# EAGLE design Teensylu2-0.7 (EAGLE 7.1.0)
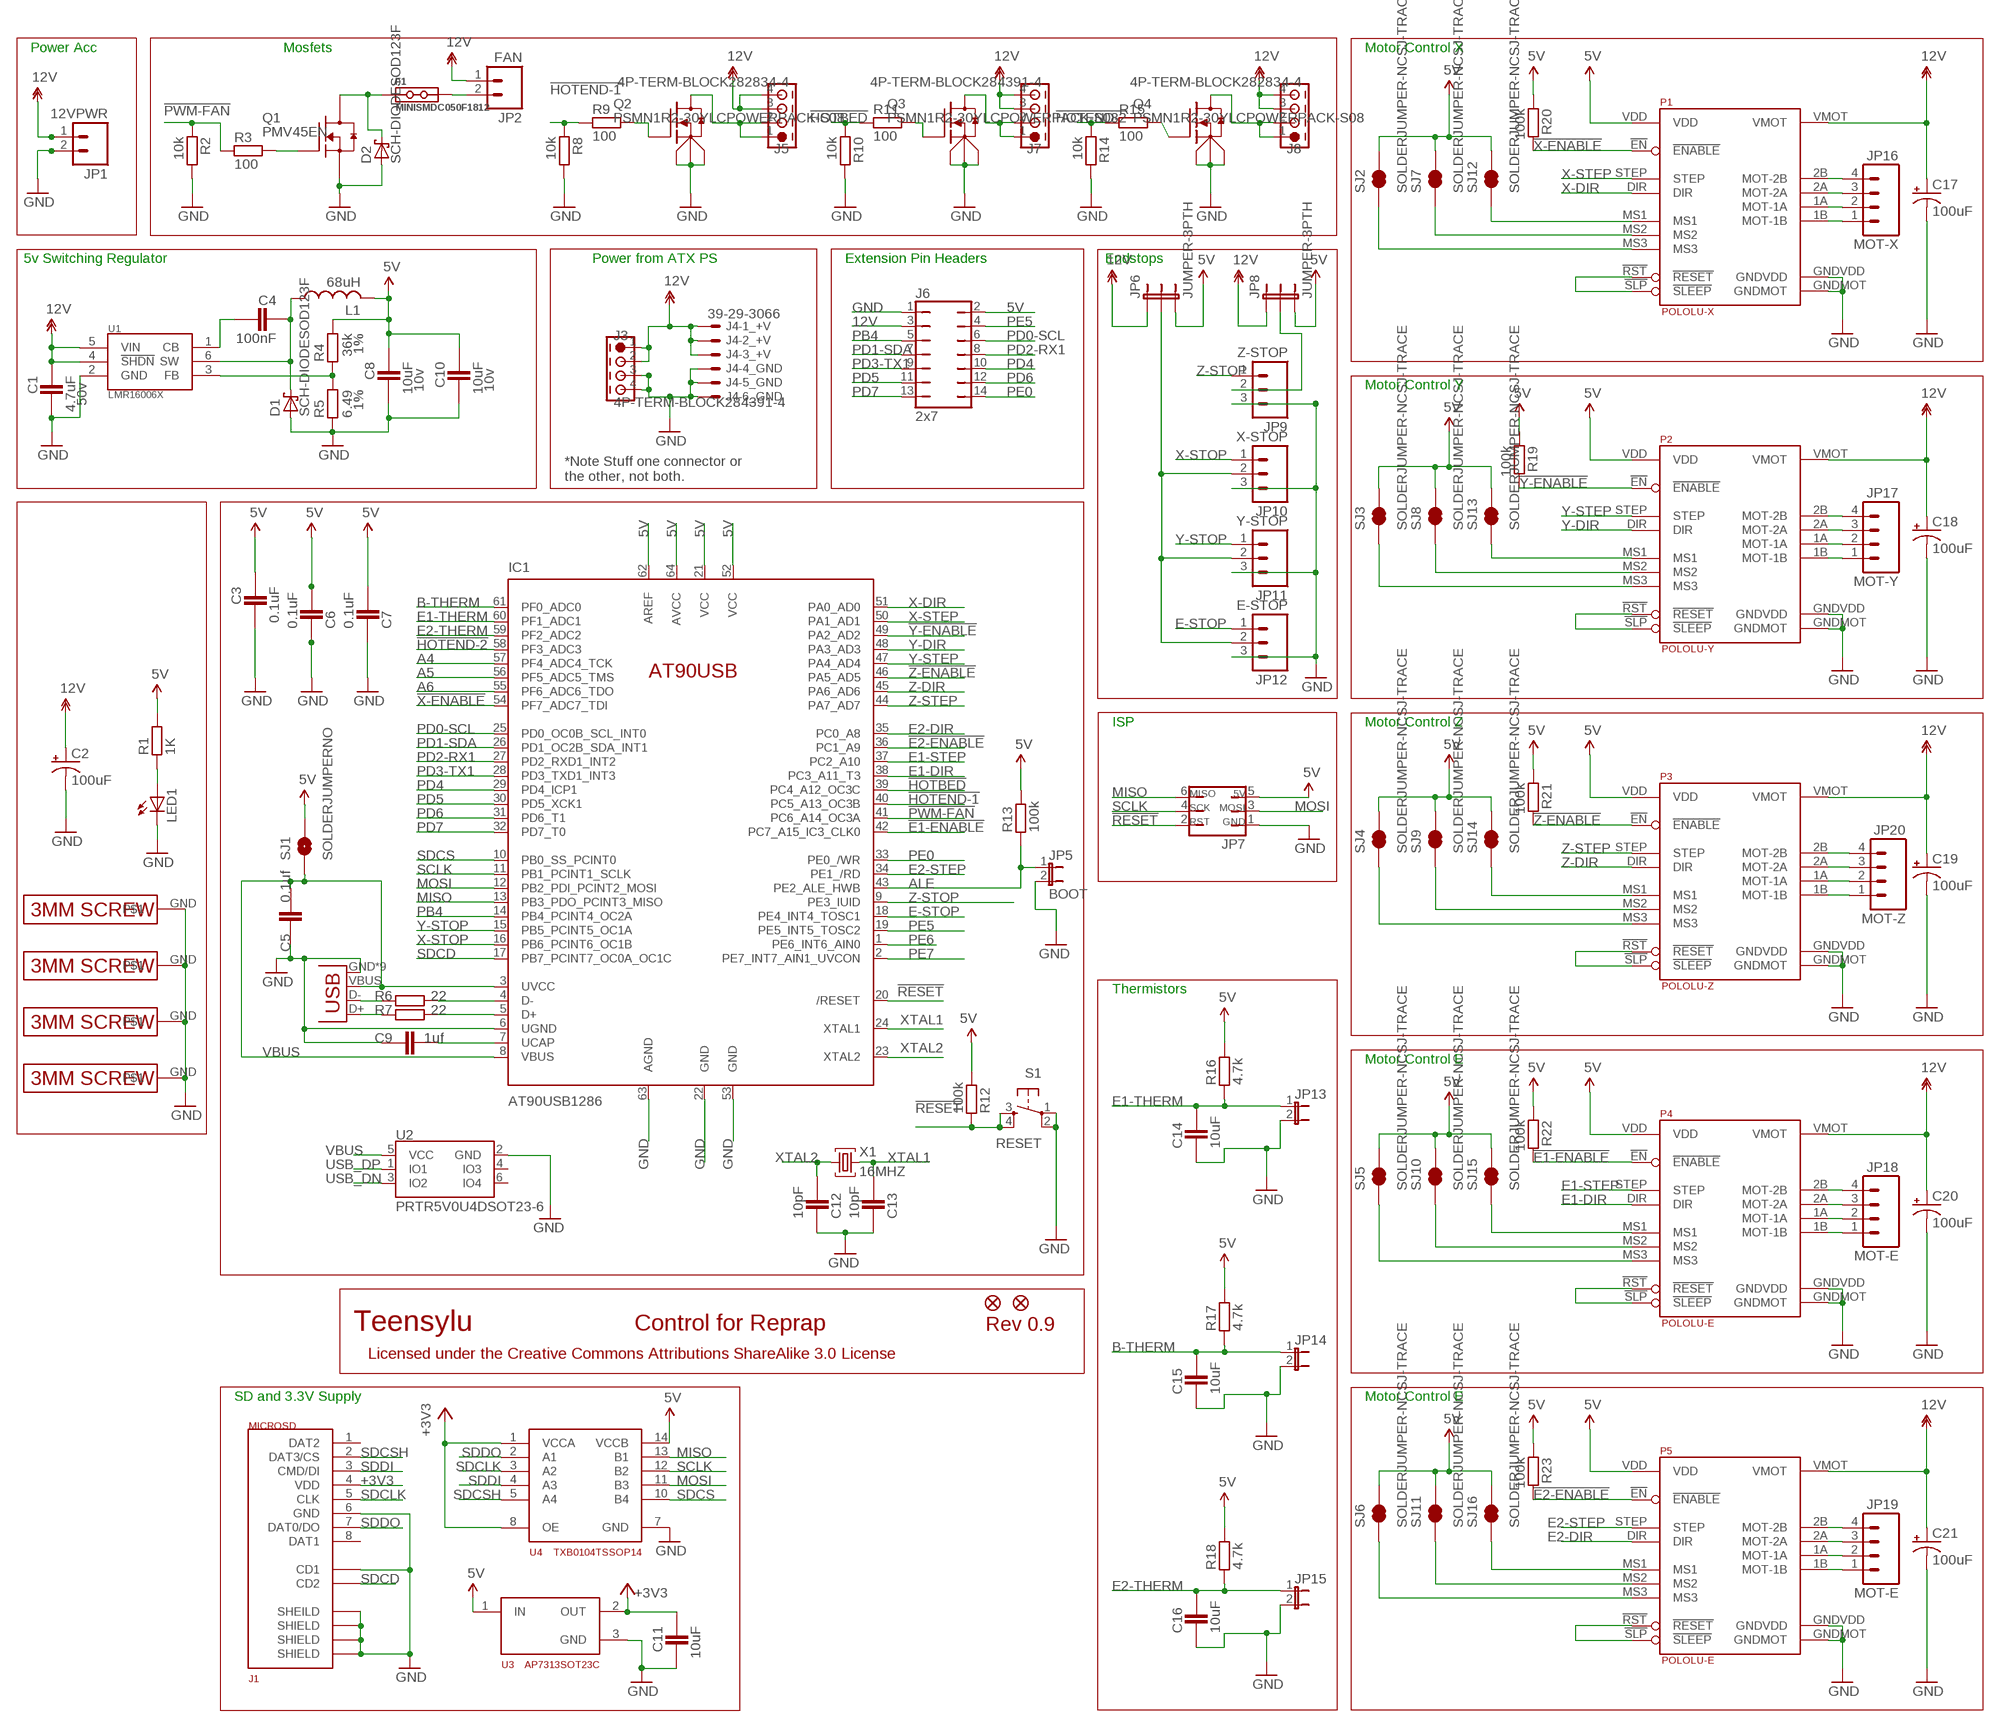
[diagram p0: schematic, sheet 1]

## Parts
C1  4.7uF  CAPACITOR_0805  [CAPC2012X145AN]
C2  100uF  CPOL-USD  [PANASONIC_D]
C3  0.1uF  CAPACITOR_0603  [CAPC1608X92N]
C4  100nF  CAPACITOR_0603  [CAPC1608X92N]
C5  0.1uf  CAPACITOR_0603  [CAPC1608X92N]
C6  0.1uF  CAPACITOR_0603  [CAPC1608X92N]
C7  0.1uF  CAPACITOR_0603  [CAPC1608X92N]
C8  10uF  CAPACITOR_0805  [CAPC2012X145AN]
C9  1uf  CAPACITOR_0603  [CAPC1608X92N]
C10  10uF  CAPACITOR_0805  [CAPC2012X145AN]
C11  10uF  CAPACITOR_0603  [CAPC1608X92N]
C12  10pF  CAPACITOR_0603  [CAPC1608X92N]
C13  10pF  CAPACITOR_0603  [CAPC1608X92N]
C14  10uF  CAPACITOR_0603  [CAPC1608X92N]
C15  10uF  CAPACITOR_0603  [CAPC1608X92N]
C16  10uF  CAPACITOR_0603  [CAPC1608X92N]
C17  100uF  CPOL-USD  [PANASONIC_D]
C18  100uF  CPOL-USD  [PANASONIC_D]
C19  100uF  CPOL-USD  [PANASONIC_D]
C20  100uF  CPOL-USD  [PANASONIC_D]
C21  100uF  CPOL-USD  [PANASONIC_D]
D1  SCH-DIODESOD123F  [SOD123F]
D2  SCH-DIODESOD123F  [SOD123F]
F1  MINISMDC050F1812  [MINISMDC]
IC1  AT90USB1286  AT90USB  [TQFP64-2]
J1  MICROSD  [AMPHENOL-MICROSD]
J2  USB-MICRO-PTH  [USB-MICROB-PTH]
J3  4P-TERM-BLOCK284391-4  [284391-4]
J4  39-29-3066  [39-29-3066]
J5  4P-TERM-BLOCK282834-4  [282834-4]
J6  2x7  JP7Q  [JP7Q]
J7  4P-TERM-BLOCK284391-4  [284391-4]
J8  4P-TERM-BLOCK282834-4  [282834-4]
JP1  12VPWR  M02POLAR  [MOLEX-1X2]
JP2  FAN  M02POLAR  [MOLEX-1X2]
JP3  FIDUCIAL1X2.5  [FIDUCIAL-1X2.5]
JP4  FIDUCIAL1X2.5  [FIDUCIAL-1X2.5]
JP5  BOOT  JUMPER-2PTH  [1X02]
JP6  JUMPER-3PTH  [1X03]
JP7  PROGHEADER  [ISP]
JP8  JUMPER-3PTH  [1X03]
JP9  Z-STOP  M03POLAR  [MOLEX-1X3]
JP10  X-STOP  M03POLAR  [MOLEX-1X3]
JP11  Y-STOP  M03POLAR  [MOLEX-1X3]
JP12  E-STOP  M03POLAR  [MOLEX-1X3]
JP13  JUMPER-2PTH  [1X02]
JP14  JUMPER-2PTH  [1X02]
JP15  JUMPER-2PTH  [1X02]
JP16  MOT-X  M04POLAR  [MOLEX-1X4]
JP17  MOT-Y  M04POLAR  [MOLEX-1X4]
JP18  MOT-E  M04POLAR  [MOLEX-1X4]
JP19  MOT-E  M04POLAR  [MOLEX-1X4]
JP20  MOT-Z  M04POLAR  [MOLEX-1X4]
L1  68uH  INDUCTORSRN6045  [SRN6045]
LED1  LEDCHIPLED_0805  [CHIPLED_0805]
P1  POLOLU-X  POLOLU-ALLEGRO  [POLOLU-STEPPER-PTH]
P2  POLOLU-Y  POLOLU-ALLEGRO  [POLOLU-STEPPER-PTH]
P3  POLOLU-Z  POLOLU-ALLEGRO  [POLOLU-STEPPER-PTH]
P4  POLOLU-E  POLOLU-ALLEGRO  [POLOLU-STEPPER-PTH]
P5  POLOLU-E  POLOLU-ALLEGRO  [POLOLU-STEPPER-PTH]
Q1  PMV45EN  MOSFET-NCH_SOT-23  [SOT23C]
Q2  PSMN1R2-30YLCPOWERPACK-S08  [LFPACK-POWERPAK-SO8]
Q3  PSMN1R2-30YLCPOWERPACK-S08  [LFPACK-POWERPAK-SO8]
Q4  PSMN1R2-30YLCPOWERPACK-S08  [LFPACK-POWERPAK-SO8]
R1  1K  RESISTOR_0603  [RESC1608X55N]
R2  10k  RESISTOR_0603  [RESC1608X55N]
R3  100  RESISTOR_0603  [RESC1608X55N]
R4  36k  RESISTOR_0603  [RESC1608X55N]
R5  6.49  RESISTOR_0603  [RESC1608X55N]
R6  22  RESISTOR_0603  [RESC1608X55N]
R7  22  RESISTOR_0603  [RESC1608X55N]
R8  10k  RESISTOR_0603  [RESC1608X55N]
R9  100  RESISTOR_0603  [RESC1608X55N]
R10  10k  RESISTOR_0603  [RESC1608X55N]
R11  100  RESISTOR_0603  [RESC1608X55N]
R12  100k  RESISTOR_0603  [RESC1608X55N]
R13  100k  RESISTOR_0603  [RESC1608X55N]
R14  10k  RESISTOR_0603  [RESC1608X55N]
R15  100  RESISTOR_0603  [RESC1608X55N]
R16  4.7k  RESISTOR_0603  [RESC1608X55N]
R17  4.7k  RESISTOR_0603  [RESC1608X55N]
R18  4.7k  RESISTOR_0603  [RESC1608X55N]
R19  100k  RESISTOR_0603  [RESC1608X55N]
R20  100k  RESISTOR_0603  [RESC1608X55N]
R21  100k  RESISTOR_0603  [RESC1608X55N]
R22  100k  RESISTOR_0603  [RESC1608X55N]
R23  100k  RESISTOR_0603  [RESC1608X55N]
S1  RESET  TAC_SWITCHPTH  [TACTILE-PTH]
SCREW1  3MM-SCREW  [PLATEDSCREW]
SCREW2  3MM-SCREW  [PLATEDSCREW]
SCREW3  3MM-SCREW  [PLATEDSCREW]
SCREW4  3MM-SCREW  [PLATEDSCREW]
SJ1  SOLDERJUMPERNO  [SJ_2S-NO]
SJ2  SOLDERJUMPER-NCSJ-TRACE  [SJ_2S-TRACE]
SJ3  SOLDERJUMPER-NCSJ-TRACE  [SJ_2S-TRACE]
SJ4  SOLDERJUMPER-NCSJ-TRACE  [SJ_2S-TRACE]
SJ5  SOLDERJUMPER-NCSJ-TRACE  [SJ_2S-TRACE]
SJ6  SOLDERJUMPER-NCSJ-TRACE  [SJ_2S-TRACE]
SJ7  SOLDERJUMPER-NCSJ-TRACE  [SJ_2S-TRACE]
SJ8  SOLDERJUMPER-NCSJ-TRACE  [SJ_2S-TRACE]
SJ9  SOLDERJUMPER-NCSJ-TRACE  [SJ_2S-TRACE]
SJ10  SOLDERJUMPER-NCSJ-TRACE  [SJ_2S-TRACE]
SJ11  SOLDERJUMPER-NCSJ-TRACE  [SJ_2S-TRACE]
SJ12  SOLDERJUMPER-NCSJ-TRACE  [SJ_2S-TRACE]
SJ13  SOLDERJUMPER-NCSJ-TRACE  [SJ_2S-TRACE]
SJ14  SOLDERJUMPER-NCSJ-TRACE  [SJ_2S-TRACE]
SJ15  SOLDERJUMPER-NCSJ-TRACE  [SJ_2S-TRACE]
SJ16  SOLDERJUMPER-NCSJ-TRACE  [SJ_2S-TRACE]
U1  LMR16006X  [TSOT6]
U2  PRTR5V0U4DSOT23-6  [SOT23-6]
U3  AP7313SOT23C  [SOT23C]
U4  TXB0104TSSOP14  [TSSOP14]
X1  16MHZ  XTAL  [NDK-XTAL]

## Nets
5V [power]: C3.1 C6.2 C7.2 C8.1 C10.1 IC1.21(VCC) IC1.52(VCC) IC1.62(AREF) IC1.64(AVCC) J6.2 JP6.3 JP7.5 JP8.3 L1.2 P1.VDD P2.VDD P3.VDD P4.VDD P5.VDD R1.2 R4.1 R12.2 R13.2 R16.2 R17.2 R18.2 R19.1 R20.1 R21.1 R22.1 R23.1 SJ1.2 SJ2.2 SJ3.2 SJ4.2 SJ5.2 SJ6.2 SJ7.2 SJ8.2 SJ9.2 SJ10.2 SJ11.2 SJ12.2 SJ13.2 SJ14.2 SJ15.2 SJ16.2 U3.1(IN) U4.14(VCCB)
5VREG_CB: C4.2 U1.1(CB)
5VREG_FB: R4.2 R5.1 U1.3(FB)
5VREG_SW: C4.1 D1.C L1.1 U1.6(SW)
12V: C1.1 C2.+ C17.+ C18.+ C19.+ C20.+ C21.+ J3.1 J3.2 J4.1 J4.2 J4.3 J5.3 J5.4 J6.3 J7.3 J7.4 J8.3 J8.4 JP1.1 JP2.1 JP6.1 JP8.1 P1.VMOT P2.VMOT P3.VMOT P4.VMOT P5.VMOT U1.4(!SHDN) U1.5(VIN)
!E1-ENABLE: IC1.42(PC7_A15_IC3_CLK0) P4.!EN(!ENABLE) R22.2
!E2-ENABLE: IC1.36(PC1_A9) P5.!EN(!ENABLE) R23.2
!HOTBED: IC1.39(PC4_A12_OC3C) R10.1 R11.1
!HOTEND-1: IC1.40(PC5_A13_OC3B) R8.1 R9.1
!HOTEND-2: IC1.58(PF3_ADC3) R14.1 R15.1
!PWM-FAN: IC1.41(PC6_A14_OC3A) R2.1 R3.1
!RESET: IC1.20(/RESET) JP7.2 R12.1 S1.3 S1.4
!X-ENABLE: IC1.54(PF7_ADC7_TDI) P1.!EN(!ENABLE) R20.2
!Y-ENABLE: IC1.49(PA2_AD2) P2.!EN(!ENABLE) R19.2
!Z-ENABLE: IC1.46(PA5_AD5) P3.!EN(!ENABLE) R21.2
+3V3 [power]: C11.1 J1.4(VDD) U3.2(OUT) U4.1(VCCA) U4.8(OE)
A4: IC1.57(PF4_ADC4_TCK)
A5: IC1.56(PF5_ADC5_TMS)
A6: IC1.55(PF6_ADC6_TDO)
ALE: IC1.43(PE2_ALE_HWB) JP5.1 R13.1
B-THERM: C15.2 IC1.61(PF0_ADC0) JP14.1 R17.1
E1-DIR: IC1.38(PC3_A11_T3) P4.DIR
E1-STEP: IC1.37(PC2_A10) P4.STEP
E1-THERM: C14.2 IC1.60(PF1_ADC1) JP13.1 R16.1
E2-DIR: IC1.35(PC0_A8) P5.DIR
E2-STEP: IC1.34(PE1_/RD) P5.STEP
E2-THERM: C16.2 IC1.59(PF2_ADC2) JP15.1 R18.1
E-MOT-1A [power]: JP18.2 P4.1A(MOT-1A)
E-MOT-1A1 [power]: JP19.2 P5.1A(MOT-1A)
E-MOT-1B [power]: JP18.1 P4.1B(MOT-1B)
E-MOT-1B1 [power]: JP19.1 P5.1B(MOT-1B)
E-MOT-2A [power]: JP18.3 P4.2A(MOT-2A)
E-MOT-2A1 [power]: JP19.3 P5.2A(MOT-2A)
E-MOT-2B [power]: JP18.4 P4.2B(MOT-2B)
E-MOT-2B1 [power]: JP19.4 P5.2B(MOT-2B)
E-MS1: P4.MS1 SJ15.1
E-MS2: P4.MS2 SJ10.1
E-MS3: P4.MS3 SJ5.1
E-MS4: P5.MS1 SJ16.1
E-MS5: P5.MS2 SJ11.1
E-MS6: P5.MS3 SJ6.1
E-RESETSLEEP: P4.!RST(!RESET) P4.!SLP(!SLEEP)
E-RESETSLEEP1: P5.!RST(!RESET) P5.!SLP(!SLEEP)
E-STOP: IC1.18(PE4_INT4_TOSC1) JP12.1
ENDSTOP+V: JP6.2 JP10.2 JP11.2 JP12.2
GND [power]: C1.2 C2.- C3.2 C5.1 C6.1 C7.1 C8.2 C9.1 C10.2 C11.2 C12.1 C13.1 C14.1 C15.1 C16.1 C17.- C18.- C19.- C20.- C21.- D1.A D2.A IC1.6(UGND) IC1.22(GND) IC1.53(GND) IC1.63(AGND) J1.6(GND) J1.C1(SHEILD) J1.C2(SHIELD) J1.C3(SHIELD) J1.C4(SHIELD) J1.CD1 J2.GND J2.GND1(GND) J2.GND2(GND) J2.GND3(GND) J2.GND4(GND) J2.GND5(GND) J2.GND6(GND) J2.GND7(GND) J2.GND8(GND) J3.3 J3.4 J4.4 J4.5 J4.6 J6.1 JP1.2 JP5.2 JP7.1 JP9.3 JP10.3 JP11.3 JP12.3 JP13.2 JP14.2 JP15.2 LED1.C P1.GNDMOT P1.GNDVDD P2.GNDMOT P2.GNDVDD P3.GNDMOT P3.GNDVDD P4.GNDMOT P4.GNDVDD P5.GNDMOT P5.GNDVDD Q1.2(S) Q2.1(S1) Q2.2(S2) Q2.3(S3) Q3.1(S1) Q3.2(S2) Q3.3(S3) Q4.1(S1) Q4.2(S2) Q4.3(S3) R2.2 R5.2 R8.2 R10.2 R14.2 S1.1 S1.2 SCREW1.GND SCREW2.GND SCREW3.GND SCREW4.GND U1.2(GND) U2.2(GND) U3.3(GND) U4.7(GND)
HOTBED-GND [power]: J7.1 J7.2 Q3.5-8(D)
HOTEND-GND [power]: J5.1 J5.2 Q2.5-8(D)
HOTEND-GND1 [power]: J8.1 J8.2 Q4.5-8(D)
MISO: IC1.13(PB3_PDO_PCINT3_MISO) JP7.6 U4.13(B1)
MOSI: IC1.12(PB2_PDI_PCINT2_MOSI) JP7.3 U4.11(B3)
N$1: LED1.A R1.1
N$2: Q3.4(G) R11.2
N$3: IC1.4(D-) R6.2
N$4: IC1.5(D+) R7.2
N$5: F1.P$2 JP2.2
N$6: D2.C F1.P$1 Q1.3(D)
N$10: Q1.1(G) R3.2
N$11: Q2.4(G) R9.2
N$13: Q4.4(G) R15.2
PB4: IC1.14(PB4_PCINT4_OC2A) J6.5
PD0-SCL: IC1.25(PD0_OC0B_SCL_INT0) J6.6
PD1-SDA: IC1.26(PD1_OC2B_SDA_INT1) J6.7
PD2-RX1: IC1.27(PD2_RXD1_INT2) J6.8
PD3-TX1: IC1.28(PD3_TXD1_INT3) J6.9
PD4: IC1.29(PD4_ICP1) J6.10
PD5: IC1.30(PD5_XCK1) J6.11
PD6: IC1.31(PD6_T1) J6.12
PD7: IC1.32(PD7_T0) J6.13
PE0: IC1.33(PE0_/WR) J6.14
PE5: IC1.19(PE5_INT5_TOSC2) J6.4
PE6: IC1.1(PE6_INT6_AIN0)
PE7: IC1.2(PE7_INT7_AIN1_UVCON)
SCLK: IC1.11(PB1_PCINT1_SCLK) JP7.4 U4.12(B2)
SDCD: IC1.17(PB7_PCINT7_OC0A_OC1C) J1.CD2
SDCLK: J1.5(CLK) U4.3(A2)
SDCS: IC1.10(PB0_SS_PCINT0) U4.10(B4)
SDCSH: J1.2(DAT3/CS) U4.5(A4)
SDDI: J1.3(CMD/DI) U4.4(A3)
SDDO: J1.7(DAT0/DO) U4.2(A1)
UCAP: C9.2 IC1.7(UCAP)
USB_DN: J2.D- R6.1 U2.3(IO2)
USB_DP: J2.D+ R7.1 U2.1(IO1)
VBUS: C5.2 IC1.3(UVCC) IC1.8(VBUS) J2.VBUS SJ1.1 U2.5(VCC)
X-DIR: IC1.51(PA0_AD0) P1.DIR
X-MOT-1A [power]: JP16.2 P1.1A(MOT-1A)
X-MOT-1B [power]: JP16.1 P1.1B(MOT-1B)
X-MOT-2A [power]: JP16.3 P1.2A(MOT-2A)
X-MOT-2B [power]: JP16.4 P1.2B(MOT-2B)
X-MS1: P1.MS1 SJ12.1
X-MS2: P1.MS2 SJ7.1
X-MS3: P1.MS3 SJ2.1
X-RESETSLEEP: P1.!RST(!RESET) P1.!SLP(!SLEEP)
X-STEP: IC1.50(PA1_AD1) P1.STEP
X-STOP: IC1.16(PB6_PCINT6_OC1B) JP10.1
XTAL1: C13.2 IC1.24(XTAL1) X1.P$2
XTAL2: C12.2 IC1.23(XTAL2) X1.P$1
Y-DIR: IC1.48(PA3_AD3) P2.DIR
Y-MOT-1A [power]: JP17.2 P2.1A(MOT-1A)
Y-MOT-1B [power]: JP17.1 P2.1B(MOT-1B)
Y-MOT-2A [power]: JP17.3 P2.2A(MOT-2A)
Y-MOT-2B [power]: JP17.4 P2.2B(MOT-2B)
Y-MS1: P2.MS1 SJ13.1
Y-MS2: P2.MS2 SJ8.1
Y-MS3: P2.MS3 SJ3.1
Y-RESETSLEEP: P2.!RST(!RESET) P2.!SLP(!SLEEP)
Y-STEP: IC1.47(PA4_AD4) P2.STEP
Y-STOP: IC1.15(PB5_PCINT5_OC1A) JP11.1
Z-DIR: IC1.45(PA6_AD6) P3.DIR
Z-MOT-1A [power]: JP20.2 P3.1A(MOT-1A)
Z-MOT-1B [power]: JP20.1 P3.1B(MOT-1B)
Z-MOT-2A [power]: JP20.3 P3.2A(MOT-2A)
Z-MOT-2B [power]: JP20.4 P3.2B(MOT-2B)
Z-MS1: P3.MS1 SJ14.1
Z-MS2: P3.MS2 SJ9.1
Z-MS3: P3.MS3 SJ4.1
Z-RESETSLEEP: P3.!RST(!RESET) P3.!SLP(!SLEEP)
Z-STEP: IC1.44(PA7_AD7) P3.STEP
Z-STOP: IC1.9(PE3_IUID) JP9.1
Z-STOP-SUPPLY: JP8.2 JP9.2
Unconnected: J1.1(DAT2) J1.8(DAT1) U2.4(IO3) U2.6(IO4)

## Notes on the sheet
- Power Acc | Mosfets | Motor Control X
- 5v Switching Regulator | Power from ATX PS | Extension Pin Headers | Endstops
- Motor Control Y
- *Note Stuff one connector or
  the other, not both.
- ISP | Motor Control Z
- Thermistors
- Motor Control E
- Teensylu | Control for Reprap | Rev 0.9
- Licensed under the Creative Commons Attributions ShareAlike 3.0 License
- SD and 3.3V Supply | Motor Control E

## Library data of the parts
C1 = teensylu:CAPACITOR_; VDC: 50v
C2 C17-C21 = rcl:CPOL-US: POLARIZED CAPACITOR, American symbol; MANUFACTURER: Panasonic; MANUFACTURER_PART_NUMBER: EEE-FTH101XAP; TOLERANCE: 20%; VDC: 50v
C3 C6 C7 = teensylu:CAPACITOR_; VDC: 10v
C4 = teensylu:CAPACITOR_; ESR: 0.0064; VDC: 50
C5 C9 C11-C16 = teensylu:CAPACITOR_
C8 C10 = teensylu:CAPACITOR_; ESR: 0.0030; VDC: 10v
D1 D2 = teensylu:SCH-DIODE: Schottky Diodes Source: Fairchild .. BAT54.pdf; CURRENT: 1A; MANUFACTURER: NXP Semiconductors; MANUFACTURER_PART_NUMBER: PMEG4010CEH,115; REVERSE_VOLTAGE: 40V
F1 = teensylu:MINISMDC050F; CURRENT: 0.5A; MANUFACTURER: TE Connectivity; MANUFACTURER_PART_NUMBER: MINISMDC050F-2
IC1 = teensylu:AT90USB
J1 = teensylu:MICROSD; MANUFACTURER: Amphenol; MANUFACTURER_PART_NUMBER: 114-00841-68
J2 = teensylu:USB: USB Connectors USB-B-PTH is fully proven SKU : PRT-00139 USB-miniB is fully proven SKU : PRT-00587 USB-A-PCB is untested. USB-A-H is throughly reviewed, but untested. Spark Fun Electronics SKU : PRT-00437 USB-B-SMT is throughly reviewed, but untested. Needs silkscreen touching up. USB-A-S has not been used/tested USB-MB-H has not been used/tested; MANUFACTURER: FCI; MANUFACTURER_PART_NUMBER: 10118194-0001LF
J3 J7 = teensylu:4P-TERM-BLOCK; CURRENT: 12A; MANUFACTURER: TE Connectivity; MANUFACTURER_PART_NUMBER: 284391-4
J4 = teensylu:39-29-3066: Mini FIT connector 6 pol Without Snap-in peg Source: http://www.molex.com; MANUFACTURER: Molex; MANUFACTURER_PART_NUMBER: 0039293066
J5 J8 = teensylu:4P-TERM-BLOCK; CURRENT: 10A; MANUFACTURER: TE Connectivity; MANUFACTURER_PART_NUMBER: 282834-4
J6 = teensylu:JP7Q: JUMPER
JP1 JP2 = teensylu:M02: Header 2 Standard 2-pin 0.1" header. Use with straight break away headers (SKU : PRT-00116), right angle break away headers (PRT-00553), swiss pins (PRT-00743), machine pins (PRT-00117), and female headers (PRT-00115). Molex polarized connector foot print use with SKU : PRT-08233 with associated crimp pins and housings.
JP3 JP4 = SparkFun:FIDUCIAL: Fiducial Alignment Points Various fiducial points for machine vision alignment.
JP5 JP13-JP15 = teensylu:JUMPER-2: Jumper Basic 0.1" spaced jumper. Use with breakaway headers.
JP6 JP8 = teensylu:JUMPER-3
JP7 = teensylu:PROGHEADER: JUMPER
JP9-JP12 = teensylu:M03: Header 3 Standard 3-pin 0.1" header. Use with straight break away headers (SKU : PRT-00116), right angle break away headers (PRT-00553), swiss pins (PRT-00743), machine pins (PRT-00117), and female headers (PRT-00115). Molex polarized connector foot print use with SKU : PRT-08232 with associated crimp pins and housings.
JP16-JP20 = teensylu:M04: Header 4 Standard 4-pin 0.1" header. Use with straight break away headers (SKU : PRT-00116), right angle break away headers (PRT-00553), swiss pins (PRT-00743), machine pins (PRT-00117), and female headers (PRT-00115). Molex polarized connector foot print use with SKU : PRT-08231 with associated crimp pins and housings. 1MM SMD Version SKU: PRT-10208
L1 = teensylu:INDUCTOR; CURRENT: 900mA; DCR: 0.351; INDUCTANCE: 68uH; IRMS: 0.9A; MANUFACTURER: Bourns; MANUFACTURER_PART_NUMBER: SRN6045-680M
LED1 = led:LED: LED OSRAM: - CHIPLED LG R971, LG N971, LY N971, LG Q971, LY Q971, LO R971, LY R971 LH N974, LH R974 LS Q976, LO Q976, LY Q976 LO Q996 - Hyper CHIPLED LW Q18S LB Q993, LB Q99A, LB R99A - SideLED LS A670, LO A670, LY A670, LG A670, LP A670 LB A673, LV A673, LT A673, LW A673 LH A674 LY A675 LS A676, LA A676, LO A676, LY A676, LW A676 LS A679, LY A679, LG A679 - Hyper Micro SIDELED® LS Y876, LA Y876, LO Y876, LY Y876 LT Y87S - SmartLED LW L88C, LW L88S LB L89C, LB L89S, LG L890 LS L89K, LO L89K, LY L89K LS L896, LA L896, LO L896, LY L896 - TOPLED LS T670, LO T670, LY T670, LG T670, LP T670 LSG T670, LSP T670, LSY T670, LOP T670, LYG T670 LG T671, LOG T671, LSG T671 LB T673, LV T673, LT T673, LW T673 LH T674 LS T676, LA T676, LO T676, LY T676, LB T676, LH T676, LSB T676, LW T676 LB T67C, LV T67C, LT T67C, LS T67K, LO T67K, LY T67K, LW E67C LS E67B, LA E67B, LO E67B, LY E67B, LB E67C, LV E67C, LT E67C LW T67C LS T679, LY T679, LG T679 LS T770, LO T770, LY T770, LG T770, LP T770 LB T773, LV T773, LT T773, LW T773 LH T774 LS E675, LA E675, LY E675, LS T675 LS T776, LA T776, LO T776, LY T776, LB T776 LHGB T686 LT T68C, LB T68C - Hyper Mini TOPLED® LB M676 - Mini TOPLED Santana® LG M470 LS M47K, LO M47K, LY M47K Source: http://www.osram.convergy.de LUXEON: - LUMILED® LXK2-PW12-R00, LXK2-PW12-S00, LXK2-PW14-U00, LXK2-PW14-V00 LXK2-PM12-R00, LXK2-PM12-S00, LXK2-PM14-U00 LXK2-PE12-Q00, LXK2-PE12-R00, LXK2-PE12-S00, LXK2-PE14-T00, LXK2-PE14-U00 LXK2-PB12-K00, LXK2-PB12-L00, LXK2-PB12-M00, LXK2-PB14-N00, LXK2-PB14-P00, LXK2-PB14-Q00 LXK2-PR12-L00, LXK2-PR12-M00, LXK2-PR14-Q00, LXK2-PR14-R00 LXK2-PD12-Q00, LXK2-PD12-R00, LXK2-PD12-S00 LXK2-PH12-R00, LXK2-PH12-S00 LXK2-PL12-P00, LXK2-PL12-Q00, LXK2-PL12-R00 Source: www.luxeon.com KINGBRIGHT: KA-3528ASYC Source: www.kingbright.com
P1-P5 = teensylu:POLOLU-ALLEGRO
Q1 = teensylu:MOSFET-NCH_; CURRENT: 1.2A; MANUFACTURER: International Rectifier; MANUFACTURER_PART_NUMBER: IRLML2060TRPBF; VOLTAGE: 60V
Q2-Q4 = teensylu:PSMN1R2-30YLC: N-Channel MOSFET - 30V 100A LFPAK; CURRENT: 100A; MANUFACTURER: NXP Semiconductors; MANUFACTURER_PART_NUMBER: PSMN1R2-30YLC,115; RDS_ON: 1.25mOhm; VGS: 1.95V; VOLTAGE: 30V
R1-R3 R6-R23 = teensylu:RESISTOR_
R4 R5 = teensylu:RESISTOR_; TOLERANCE: 1%
S1 = SparkFun:TAC_SWITCH: Momentary Switch Button commonly used for reset or general input. Spark Fun Electronics SKU : COM-00097
SCREW1-SCREW4 = teensylu:3MM-SCREW: 3mm Plated Through Hole Screw
SJ1 = teensylu:SOLDERJUMPER: Solder Jumper Standard SMD solder jumper. Used to automate production. Two varients : Normally Open and Normally Closed are the same, but have different paste layers. NC will have a large amount of paste and should jumper during reflow.
SJ2-SJ16 = teensylu:SOLDERJUMPER-NC
U1 = teensylu:LMR16006X: Texas Instruments LMR16006XDDCT; CURRENT: 600mA; MANUFACTURER: Texas Instruments; MANUFACTURER_PART_NUMBER: LMR16006XDDCT
U2 = teensylu:PRTR5V0U4D: NXP Semiconductors PRTR5V0U4D,125; MANUFACTURER: NXP Semiconductors; MANUFACTURER_PART_NUMBER: PRTR5V0U4D,125
U3 = teensylu:AP7313; CURRENT: 150mA; MANUFACTURER: Diodes Incorporated; MANUFACTURER_PART_NUMBER: AP7313-33SAG-7; VOLTAGE_OUTPUT: 3.3V
U4 = teensylu:TXB0104; MANUFACTURER: Texas Instruments; MANUFACTURER_PART_NUMBER: TXB0104PWR
X1 = teensylu:XTAL

## Board
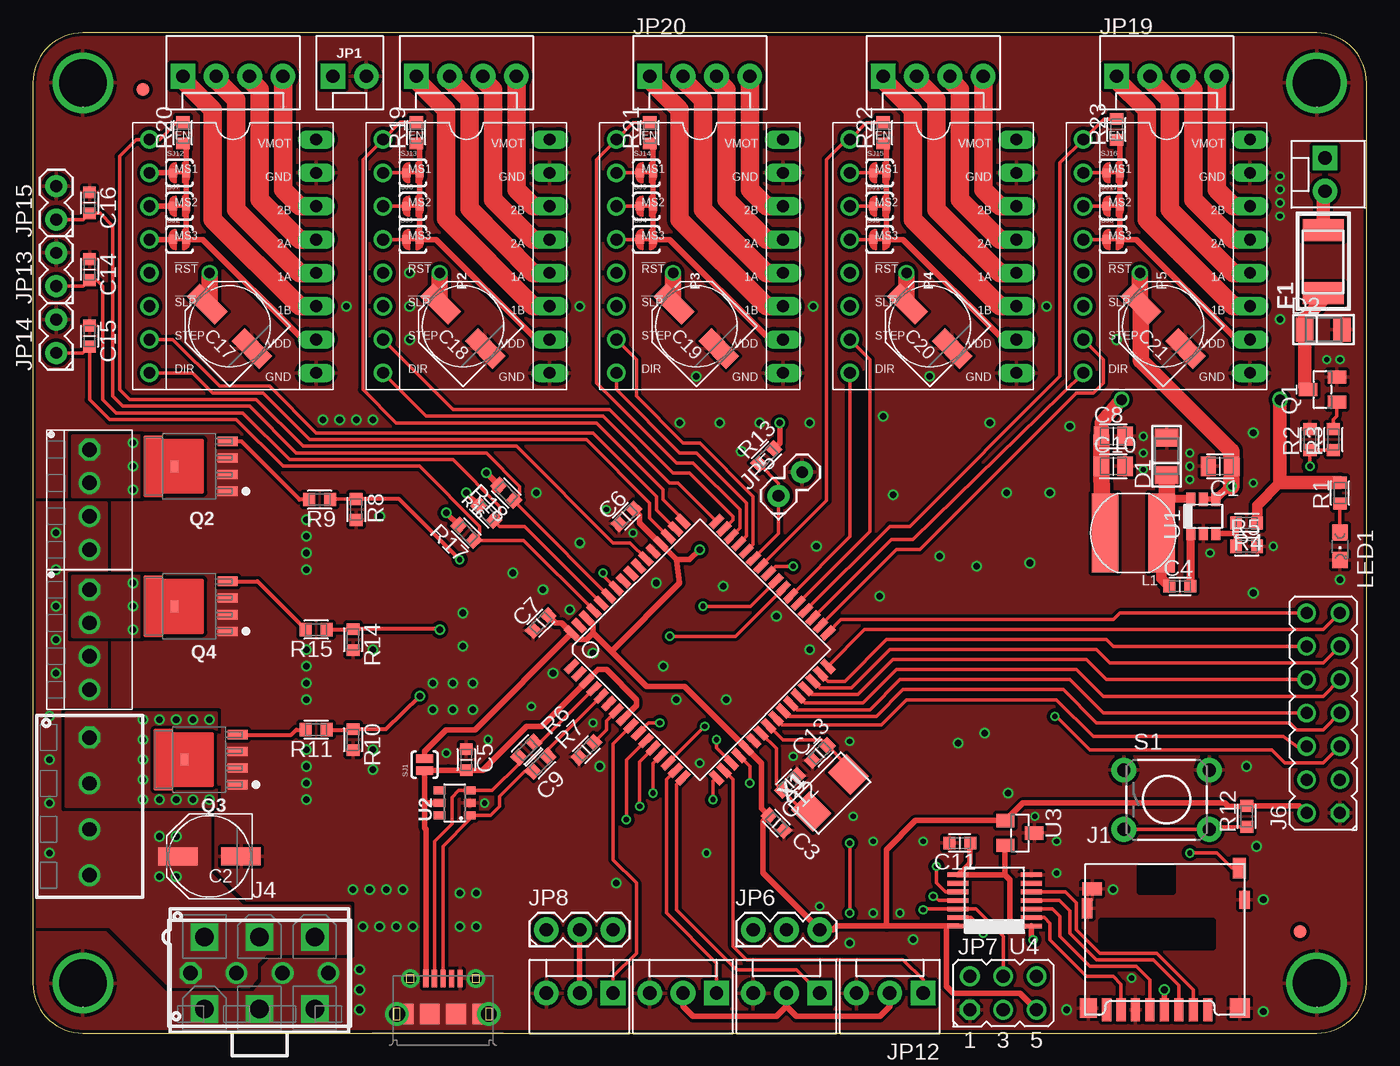
[diagram p1: board, top side]
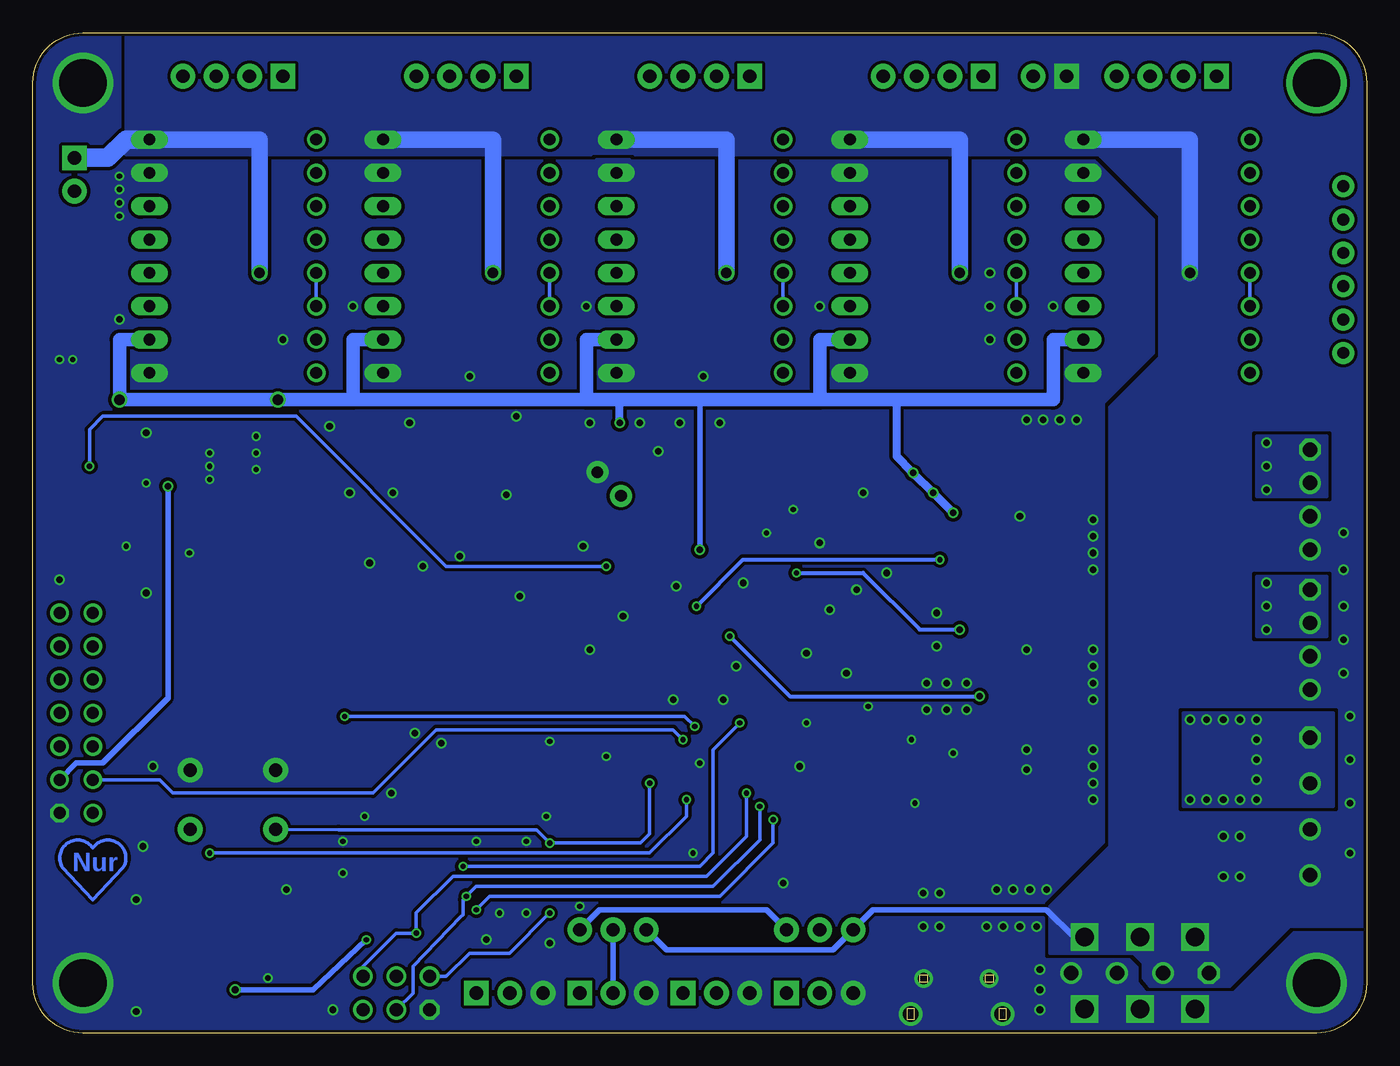
[diagram p2: board, bottom side, seen from below]

Size 101.6 x 76.2 mm. Coordinates in mm from the lower left corner, seen from the top.
Outline: 0,3.81 arc90 3.81,0 97.79,0 arc90 101.6,3.81 101.6,72.39 arc90 97.79,76.2 3.81,76.2 arc90 0,72.39 0,3.81
Copper layers (1*16): Top 0.035mm / dielectric 1.5mm / Bottom 0.035mm
Design rules "Teensylu Custom *": minimum track width 10mil, minimum drill 15mil, track to track 9mil, track to pad 9mil, pad to pad 9mil, via to via 9mil, smd to smd 0mil, copper to edge 10mil, drill to drill 10mil, minimum pad ring 10mil, minimum via ring 6mil, stop-mask expansion 2mil, vias tented up to drill 100mil, thermal gap 10mil

### Footprints (pad centres in the part's own frame; a part is rotated, then mirrored left to right if it is on the bottom)
CAPC2012X145AN = smd 1.15 x 1.45: 1 -0.9,0; 2 0.9,0
PANASONIC_D = smd 3 x 1.4: + 2.4,0; - -2.4,0
CAPC1608X92N = smd 0.9 x 0.95: 1 -0.8,0; 2 0.8,0
SOD123F = smd 1.34 x 1.8: A 1.43,0; C -1.43,0
MINISMDC = smd 1.676 x 3.15: P$1 -2.286,0; P$2 2.489,0
TQFP64-2 = smd 1.194 x 0.508: 1 -7.8,6; 2 -7.8,5.2; 3 -7.8,4.4; 4 -7.8,3.6; 5 -7.8,2.8; 6 -7.8,2; 7 -7.8,1.2; 8 -7.8,0.4; 9 -7.8,-0.4; 10 -7.8,-1.2; 11 -7.8,-2; 12 -7.8,-2.8; 13 -7.8,-3.6; 14 -7.8,-4.4; 15 -7.8,-5.2; 16 -7.8,-6; 33 7.8,-6; 34 7.8,-5.2; 35 7.8,-4.4; 36 7.8,-3.6; 37 7.8,-2.8; 38 7.8,-2; 39 7.8,-1.2; 40 7.8,-0.4; 41 7.8,0.4; 42 7.8,1.2; 43 7.8,2; 44 7.8,2.8; 45 7.8,3.6; 46 7.8,4.4; 47 7.8,5.2; 48 7.8,6 | smd 0.508 x 1.194: 17 -6,-7.8; 18 -5.2,-7.8; 19 -4.4,-7.8; 20 -3.6,-7.8; 21 -2.8,-7.8; 22 -2,-7.8; 23 -1.2,-7.8; 24 -0.4,-7.8; 25 0.4,-7.8; 26 1.2,-7.8; 27 2,-7.8; 28 2.8,-7.8; 29 3.6,-7.8; 30 4.4,-7.8; 31 5.2,-7.8; 32 6,-7.8; 49 6,7.8; 50 5.2,7.8; 51 4.4,7.8; 52 3.6,7.8; 53 2.8,7.8; 54 2,7.8; 55 1.2,7.8; 56 0.4,7.8; 57 -0.4,7.8; 58 -1.2,7.8; 59 -2,7.8; 60 -2.8,7.8; 61 -3.6,7.8; 62 -4.4,7.8; 63 -5.2,7.8; 64 -6,7.8
AMPHENOL-MICROSD = smd 0.7 x 1.75: 1 3.636,-5.842; 2 2.536,-5.842; 3 1.436,-5.842; 4 0.336,-5.842; 5 -0.764,-5.842; 6 -1.864,-5.842; 7 -2.964,-5.842; 8 -4.064,-5.842 | smd 1.29 x 1.5: C1 -5.464,-5.717 | smd 1.5 x 1.5: C2 6.086,-5.717 | smd 0.8 x 1.5: C3 -5.539,1.883 | smd 0.8 x 1.4: C4 6.436,2.533 | smd 1.5 x 1: CD1 -5.164,3.383 | smd 1 x 1.55: CD2 6.036,4.958
USB-MICROB-PTH = smd 0.4 x 1.35: D+ 0,2.699; D- -0.65,2.699; GND 1.3,2.699; ID 0.65,2.699; VBUS -1.3,2.699 | drill 1.2 pad 1.676: GND1 -3.5,-0.001; GND6 3.5,-0.001 | smd 1.225 x 1.55: GND2 -2.86,-0.001 | smd 1.5 x 1.55: GND3 -1,-0.001; GND4 1,-0.001 | smd 1.2 x 1.55: GND5 2.86,-0.001 | drill 0.9 pad 1.27: GND7 2.5,2.7; GND8 -2.5,2.7
284391-4 = drill 1.1 octagon: 1 -5.25,0 | drill 1.1: 2 -1.753,0; 3 1.753,0; 4 5.25,0
39-29-3066 = drill 1.4 square: 1 4.2,-2.75; 2 0,-2.75; 3 -4.2,-2.75; 4 4.2,2.75; 5 0,2.75; 6 -4.2,2.75
282834-4 = drill 1.1 octagon: 1 -3.81,0 | drill 1.1: 2 -1.27,0; 3 1.27,0; 4 3.81,0
JP7Q = drill 0.914 octagon: 1 -7.62,-1.27 | drill 0.914: 2 -7.62,1.27; 3 -5.08,-1.27; 4 -5.08,1.27; 5 -2.54,-1.27; 6 -2.54,1.27; 7 0,-1.27; 8 0,1.27; 9 2.54,-1.27; 10 2.54,1.27; 11 5.08,-1.27; 12 5.08,1.27; 13 7.62,-1.27; 14 7.62,1.27
MOLEX-1X2 = drill 1.016 pad 1.88 square: 1 0,0 | drill 1.016 pad 1.88: 2 2.54,0
FIDUCIAL-1X2.5 = smd 1 x 1: 1 0,0
1X02 = drill 0.9 pad 1.676: 1 0,0; 2 2.54,0
1X03 = drill 1.016 pad 1.88: 1 0,0; 2 2.54,0; 3 5.08,0
ISP = drill 1 octagon: 1 -2.54,-1.27 | drill 1: 2 -2.54,1.27; 3 0,-1.27; 4 0,1.27; 5 2.54,-1.27; 6 2.54,1.27
MOLEX-1X3 = drill 1.016 pad 1.88 square: 1 0,0 | drill 1.016 pad 1.88: 2 2.54,0; 3 5.08,0
MOLEX-1X4 = drill 1.016 pad 1.88 square: 1 0,0 | drill 1.016 pad 1.88: 2 2.54,0; 3 5.08,0; 4 7.62,0
SRN6045 = smd 2 x 6: 1 -2.15,0; 2 2.15,0
CHIPLED_0805 = smd 1.2 x 1.2: A 0,-1.05; C 0,1.05
POLOLU-STEPPER-PTH = drill 0.9 long: 1A 6.35,-1.27; 1B 6.35,-3.81; 2A 6.35,1.27; 2B 6.35,3.81; GNDMOT 6.35,6.35; GNDVDD 6.35,-8.89; VDD 6.35,-6.35; VMOT 6.35,8.89 | drill 0.9: !EN -6.35,8.89; !RST -6.35,-1.27; !SLP -6.35,-3.81; DIR -6.35,-8.89; MS1 -6.35,6.35; MS2 -6.35,3.81; MS3 -6.35,1.27; STEP -6.35,-6.35
SOT23C = smd 1 x 1.4: 1 -0.95,-1.1; 2 0.95,-1.1; 3 0,1.1
LFPACK-POWERPAK-SO8 = smd 0.7 x 1.5: 1 -1.905,-2.9; 2 -0.635,-2.9; 3 0.635,-2.9; 4 1.905,-2.9 | smd 0.9 x 0.6: 5-8 0,1.15
RESC1608X55N = smd 0.9 x 1: 1 -0.8,0; 2 0.8,0
TACTILE-PTH = drill 1.016 pad 1.88: 1 -3.251,2.261; 2 3.251,2.261; 3 -3.251,-2.261; 4 3.251,-2.261
PLATEDSCREW = drill 3.6: GND 0,0
SJ_2S-NO = smd 0.635 x 1.27: 1 -0.45,0; 2 0.45,0
SJ_2S-TRACE = smd 0.635 x 0.635: 1 -0.508,0; 2 0.508,0
TSOT6 = smd 0.69 x 1: 1 -0.95,-1.3; 2 0,-1.3; 3 0.95,-1.3; 4 0.95,1.3; 5 0,1.3; 6 -0.95,1.3
SOT23-6 = smd 0.6 x 0.9: 1 -0.95,-1.15; 2 0,-1.15; 3 0.95,-1.15; 4 0.95,1.15; 5 0,1.15; 6 -0.95,1.15
TSSOP14 = smd 0.35 x 1.6: 1 -2,-2.9; 2 -1.35,-2.9; 3 -0.7,-2.9; 4 -0.05,-2.9; 5 0.6,-2.9; 6 1.25,-2.9; 7 1.9,-2.9; 8 1.9,2.7; 9 1.25,2.7; 10 0.6,2.7; 11 -0.05,2.7; 12 -0.7,2.7; 13 -1.35,2.7; 14 -2,2.7
NDK-XTAL = smd 2 x 2.4: P$1 -2,0; P$2 2,0

### Placement (x,y rotation side)
C1  90.42,43.18 180 top
C2  13.46,13.46 180 top
C3  56.64,16 315 top
C4  87.38,34.04 0 top
C5  33.02,20.83 270 top
C6  45.21,39.37 45 top
C7  38.69,31.24 45 top
C8  82.3,45.47 0 top
C9  42.16,21.59 45 top
C10  82.3,43.18 0 top
C11  70.61,14.48 180 top
C12  57.66,19.05 225 top
C13  59.94,21.34 45 top
C14  4.32,58.17 270 top
C15  4.32,53.09 270 top
C16  4.32,63.25 270 top
C17  14.99,53.85 135 top
C18  32.77,53.85 135 top
C19  50.55,53.85 135 top
C20  68.33,53.85 135 top
C21  86.11,53.85 135 top
D1  86.36,43.94 90 top
D2  98.3,53.59 0 top
F1  98.3,58.67 90 top
IC1  50.8,29.21 45 top
J1  85.85,7.62 0 top
J2  31.24,1.46 0 top
J3  17.27,4.57 0 top
J4  17.27,4.57 180 top
J5  4.32,40.64 270 top
J6  98.3,24.38 90 top
J7  4.32,17.27 270 top
J8  4.32,29.97 270 top
JP1  22.86,72.9 0 top
JP2  98.42,66.67 270 top
JP3  8.38,71.88 0 top
JP4  96.52,7.75 0 top
JP5  56.81,40.93 45 top
JP6  54.86,7.87 0 top
JP7  73.91,3.05 0 top
JP8  39.12,7.87 0 top
JP9  44.2,3.05 180 top
JP10  59.94,3.05 180 top
JP11  52.07,3.05 180 top
JP12  67.82,3.05 180 top
JP13  1.78,56.9 90 top
JP14  1.78,51.82 90 top
JP15  1.78,61.98 90 top
JP16  11.43,72.9 0 top
JP17  29.21,72.9 0 top
JP18  64.77,72.9 0 top
JP19  82.55,72.9 0 top
JP20  46.99,72.9 0 top
L1  83.82,38.1 180 top
LED1  99.57,37.08 180 top
P1  15.24,59.18 0 top
P2  33.02,59.18 0 top
P3  50.8,59.18 0 top
P4  68.58,59.18 0 top
P5  86.36,59.18 0 top
Q1  98.23,49.02 90 top
Q2  11.94,43.18 90 top
Q3  12.7,20.83 90 top
Q4  11.94,32.51 90 top
R1  99.57,41.15 90 top
R2  97.28,45.21 90 top
R3  99.06,45.21 90 top
R4  92.46,38.86 180 top
R5  92.46,37.08 0 top
R6  37.59,21.59 45 top
R7  38.67,20.51 45 top
R8  24.64,39.88 270 top
R9  21.84,40.64 180 top
R10  24.38,22.35 270 top
R11  21.59,23.11 180 top
R12  92.46,16.51 90 top
R13  55.88,43.94 45 top
R14  24.38,29.97 270 top
R15  21.59,30.73 180 top
R16  34.54,39.62 135 top
R17  33.02,38.1 135 top
R18  36.07,41.15 135 top
R19  29.21,68.58 90 top
R20  11.43,68.58 90 top
R21  46.99,68.58 90 top
R22  64.77,68.58 90 top
R23  82.55,68.83 90 top
S1  86.36,17.78 0 top
SCREW1  3.81,72.39 0 top
SCREW2  3.81,3.81 0 top
SCREW3  97.79,72.39 0 top
SCREW4  97.79,3.81 0 top
SJ1  29.84,20.45 90 top
SJ2  11.18,60.45 0 top
SJ3  28.96,60.45 0 top
SJ4  46.74,60.45 0 top
SJ5  64.52,60.45 0 top
SJ6  82.3,60.45 0 top
SJ7  11.18,62.99 0 top
SJ8  28.96,62.99 0 top
SJ9  46.74,62.99 0 top
SJ10  64.52,62.99 0 top
SJ11  82.3,62.99 0 top
SJ12  11.18,65.53 0 top
SJ13  28.96,65.53 0 top
SJ14  46.74,65.53 0 top
SJ15  64.52,65.53 0 top
SJ16  82.3,65.53 0 top
U1  89.15,39.37 0 top
U2  32.13,17.53 90 top
U3  75.18,15.24 270 top
U4  73.15,10.16 90 top
X1  60.71,18.29 45 top

### Tracks (layer width: path | path; a pad name or v marks a point on that pad's centre or on a via)
5V  (via drill 0.5, 0.5 pad 0.25, 0.8)
  Top 0.254: R12.2 92.42,17.27
  Top 0.406: P2.VDD 38.35,52.83 30.73,60.45 SJ3.2 SJ8.2 SJ13.2 29.46,67.53 R19.1 | P1.VDD 20.57,52.83 12.95,60.45 SJ2.2 SJ7.2 SJ12.2 11.68,67.53 R20.1 | P3.VDD 56.13,52.83 48.51,60.45 SJ4.2 SJ9.2 SJ14.2 47.24,67.53 R21.1 | P4.VDD 73.91,52.83 66.29,60.45 SJ5.2 SJ10.2 SJ15.2 65.02,67.53 R22.1 | P5.VDD 91.69,52.83 84.07,60.45 SJ6.2 SJ11.2 SJ16.2 82.8,67.78 R23.1 | IC1.64 41.55,29.97 42.16,29.97 42.67,30.48 | U4.14 69.6,8.16 | 69.6,8.16 65.02,8.16 | 65.02,8.16 61.25,8.16 60.96,7.87 JP6.3 55.63,12.19 55.63,16.12 C3.1 55.52,17.13 55.52,20.54 IC1.21 49.63,26.42 46.74,26.42 44.07,29.08 | JP7.5 75.18,3.05 70.1,3.05 69.6,3.56 69.6,8.16 | 65.02,8.16 65.02,13.97 67.24,16.19 U3.1 75.42,17.53 90.81,17.53 91.06,17.27 92.42,17.27 | J6.2 96.48,17.31 R12.2 | SJ1.2 29.84,21.46 31.5,23.11 33.67,23.11 IC1.64 | R13.2 56.9,44.96 v56.9,46.48 | v50.8,36.83 50.04,36.07 49.03,36.07 | 49.03,36.07 IC1.52 46.23,38.87 46.23,39.48 C6.2 | IC1.62 42.67,31.11 42.67,30.48 | 42.67,30.48 44.07,29.08 | 49.03,36.07 49.02,36.06 49.28,34.29 44.07,29.08 | R18.2 v34.54,42.67 | v34.54,42.67 | R16.2 v33.02,41.15 | v33.02,41.15 | R17.2 v31.5,39.62 | v31.5,39.62 | C7.2 39.81,31.24 40.28,31.24 IC1.64
  Top 0.61: R18.2 35.25,41.46
  Top 0.813: R4.1 93.26,40.21 95,41.95
  Top 1.016: R1.2 95,41.95 v95,48.26 | C8.1 81.41,46.49 v82.93,48.26
  Top 1.27: C8.1 C10.1 81.42,40.64 L1.2
  Bottom 0.406: v50.8,36.83 50.8,48.26 | JP8.3 45.72,9.4 58.42,9.4 JP6.3
  Bottom 0.61: 35.81,48.26 35.81,43.94 v34.54,42.67 v33.02,41.15 v31.5,39.62 | v56.9,46.48 56.9,48.26
  Bottom 1.016: 77.22,48.26 77.22,52.83 P4.VDD | P5.VDD 95,52.83 v95,48.26 v82.93,48.26 77.22,48.26 | P3.VDD 59.44,52.83 59.44,48.26 | 59.44,48.26 77.22,48.26 | 59.44,48.26 56.9,48.26 50.8,48.26 41.66,48.26 | 41.66,48.26 41.66,52.83 P2.VDD | 41.66,48.26 35.81,48.26 23.88,48.26 23.88,52.83 P1.VDD
5VREG_CB
  Top 0.61: C4.2 88.2,34.06 U1.1
5VREG_FB
  Top 0.406: U1.3 91.66,38.07 | 91.66,38.07 R4.2 | R5.1 91.66,38.07
5VREG_SW
  Top 0.61: U1.6 86.36,40.67
  Top 0.813: 86.36,40.67 D1.C | C4.1 85.97,34.64 L1.1
  Top 1.27: L1.1 86.36,38.1 D1.C
12V  (via drill 0.5, 0.8)
  Top 0.406: U1.5 U1.4
  Top 0.61: 91.09,41.66 U1.4
  Top 0.813: v91.3,41.66 91.09,41.66
  Top 1.016: 13.46,55.72 C17.+
  Top 1.27: v91.3,41.66 C1.1 91.3,44.33 84.41,51.23 C21.+ 84.33,55.63 v84.33,57.91 | v13.46,57.91 13.46,55.72 | v30.99,57.91 30.99,55.63 C18.+ | v48.77,57.91 48.77,55.63 C19.+ | v66.55,57.91 66.55,55.63 C20.+
  Bottom 0.406: J4.3 22.31,7.32 24.38,9.4 37.59,9.4 JP8.1 40.64,6.35 53.34,6.35 JP6.1 | J6.3 98.3,20.57 96.27,20.57 91.3,25.54 v91.3,41.66
  Bottom 1.27: P2.VMOT 30.99,68.07 v30.99,57.91 | P1.VMOT 13.46,68.07 v13.46,57.91 | P3.VMOT 48.77,68.07 v48.77,57.91 | P4.VMOT 66.55,68.07 v66.55,57.91 | P5.VMOT 84.33,68.07 v84.33,57.91
  Bottom 1.422: JP2.1 95.89,66.67 94.49,68.07 P5.VMOT
  other vias: 9.65,14.99 9.65,11.94 10.92,11.94 10.92,14.99 1.27,24.13 1.27,17.53 1.27,20.83 1.78,27.43 1.78,29.97 1.78,32.51 1.78,35.31 1.78,38.1 1.27,13.72
  pour Bottom (rank 2, no thermals): -1.27,8.13 24.13,8.13 24.13,9.65 19.56,14.22 19.56,65.66 20.32,66.93 94.49,66.93 94.49,77.98 -1.27,77.98
  pour Bottom (no thermals): 5.84,8.13 10.41,9.65 24.13,9.65 24.13,6.1 17.78,6.1 17.02,5.33 17.02,4.19 16.51,3.56 10.41,3.56
  pour Top (rank 2, no thermals): -0.25,40.39 5.59,40.39 5.59,17.02 13.46,17.02 13.46,12.19 16,9.65 24.13,9.65 24.13,6.1 17.78,6.1 17.02,5.33 17.02,4.19 16.51,3.56 10.41,3.56 5.84,8.13 -0.25,8.13
!E1-ENABLE
  Top 0.254: R22.2 64.77,69.34 63.5,69.34 P4.!EN 61.98,68.07 60.45,66.55 60.45,40.56 IC1.42
!E2-ENABLE
  Top 0.254: R23.2 81.57,69.63 P5.!EN 78.23,66.29 78.23,50.04 66.8,38.61 65.28,38.6 IC1.36
!HOTBED  (via drill 0.4, 0.5)
  Top 0.254: 24.35,23.11 R10.1 | IC1.39 53.51,30.23 v48.51,30.23
  Top 0.305: v29.46,25.65 26.89,23.15 R10.1 | R11.1 24.35,23.11
  Bottom 0.305: v48.51,30.23 43.94,25.65 v29.46,25.65
!HOTEND-1  (via drill 0.4)
  Top 0.254: R8.1 22.94,40.68 R9.1 | IC1.40 54.67,32.51 v51.05,32.51
  Top 0.305: v32.51,36.07 27.9,40.68 R8.1
  Bottom 0.305: v51.05,32.51 47.5,36.07 v32.51,36.07
!HOTEND-2  (via drill 0.4 pad 0.25, 0.5 pad 0.25)
  Top 0.254: 24.35,30.73 R14.1 | IC1.58 43.52,34.8 v43.43,35.05
  Top 0.305: 30.95,30.77 R14.1 | R15.1 24.35,30.73
  Top 0.406: v30.99,30.73 30.95,30.77
  Bottom 0.305: v43.43,35.05 38.35,35.05 34.04,30.73 v30.99,30.73
!PWM-FAN  (via drill 0.4)
  Top 0.254: IC1.41 56.58,35.56 v57.91,35.56 | v97.28,43.18 R2.1 R3.1
  Bottom 0.254: v57.91,35.56 70.1,35.56 81.53,46.99 96.27,46.99 97.28,45.97 v97.28,43.18
!RESET  (via drill 0.4)
  Top 0.254: v62.23,9.14 v62.23,14.48 | S1.3 S1.4 89.8,15.71 R12.1 | IC1.20 54.61,20.31 v54.61,19.05
  Bottom 0.254: JP7.2 70.1,4.32 68.33,6.1 65.28,6.1 v62.23,9.14 | S1.3 78.31,15.49 63.25,15.49 v62.23,14.48 55.33,14.48 54.61,15.2 v54.61,19.05
!X-ENABLE
  Top 0.254: R20.2 11.39,69.34 10.92,69.34 9.65,68.07 P1.!EN 7.87,68.07 6.6,66.8 6.6,49.02 7.37,48.26 17.02,48.26 20.57,44.7 36.86,44.7 44.2,37.34 45.5,37.34 IC1.54
!Y-ENABLE
  Top 0.254: IC1.49 49.53,39.11 48.01,40.63 48.01,41.4 42.93,46.48 27.69,46.48 25.15,49.02 25.15,66.55 P2.!EN 27.98,69.38 R19.2
!Z-ENABLE
  Top 0.254: R21.2 46.99,69.34 45.72,69.34 P3.!EN 42.93,66.55 42.93,49.53 49.02,43.43 50.29,43.43 53.85,39.88 53.85,38.48 IC1.46
+3V3  (via drill 0.4, 0.5)
  Top 0.254: 74.04,14.35 U3.2
  Top 0.406: 74.04,12.06 U4.8 71.21,12.79 71.37,12.95 71.37,14.59 C11.1 | 74.04,12.06 74.05,12.06 74.42,11.68 74.42,8.64 74.93,8.13 75.51,8.13 U4.1 76.05,7.26 v76.2,7.11 | v86.19,3.3 J1.4 | 74.04,12.06 74.04,13.74 U3.2
  Bottom 0.406: v86.19,3.3 80.26,3.3 v76.2,7.11
ALE
  Top 0.254: IC1.43 56.81,38.05 JP5.1 56.81,41.88 R13.1
B-THERM
  Top 0.254: JP14.1 3.81,51.82 4.28,52.29 C15.2 4.32,48.26 5.84,46.74 15.49,46.74 19.05,43.18 29.46,43.18 34.04,38.61 34.04,37.98 R17.1 37.38,37.53 IC1.61
E1-DIR
  Top 0.254: IC1.38 62.23,37.81 P4.DIR
E1-STEP
  Top 0.254: IC1.37 63.75,38.2 63.75,51.31 P4.STEP
E1-THERM
  Top 0.254: JP13.1 3.85,56.9 C14.2 4.86,57.37 5.33,56.9 5.33,48.26 6.35,47.24 16,47.24 19.56,43.69 32,43.69 35.56,40.13 35.56,39.51 R16.1 35.56,38.61 37.44,38.61 37.65,38.4 37.77,38.28 IC1.60
E2-DIR
  Top 0.254: P5.DIR 67.06,37.59 65.79,37.59 65.53,37.59 65.41,37.59 IC1.35
E2-STEP
  Top 0.254: P5.STEP 81.53,51.31 81.53,49.53 80.77,48.77 79.5,48.77 67.56,36.83 65.79,36.84 IC1.34
E2-THERM
  Top 0.254: JP15.1 3.85,61.98 C16.2 5.12,62.45 6.1,61.47 6.1,48.51 6.86,47.75 16.51,47.75 20.07,44.2 34.54,44.2 37.08,41.66 37.08,41.03 R18.1 37.65,39.53 IC1.59
E-MOT-1A
  Top 1.422: JP18.2 67.31,72.64 68.83,71.12 68.83,62.74 73.66,57.91 P4.1A
E-MOT-1A1
  Top 1.422: JP19.2 85.09,72.64 86.61,71.12 86.61,62.74 91.44,57.91 P5.1A
E-MOT-1B
  Top 1.422: JP18.1 64.77,72.64 67.06,70.36 67.06,61.98 73.66,55.37 P4.1B
E-MOT-1B1
  Top 1.422: JP19.1 82.55,72.64 84.84,70.36 84.84,61.98 91.44,55.37 P5.1B
E-MOT-2A
  Top 1.422: JP18.3 69.85,72.64 70.61,71.88 70.61,63.5 73.66,60.45 P4.2A
E-MOT-2A1
  Top 1.422: JP19.3 87.63,72.64 88.39,71.88 88.39,63.5 91.44,60.45 P5.2A
E-MOT-2B
  Top 1.422: JP18.4 72.39,64.26 73.66,62.99 P4.2B
E-MOT-2B1
  Top 1.422: JP19.4 90.17,64.26 91.44,62.99 P5.2B
E-MS1
  Top 0.254: P4.MS1 SJ15.1
E-MS2
  Top 0.254: P4.MS2 SJ10.1
E-MS3
  Top 0.254: P4.MS3 SJ5.1
E-MS4
  Top 0.254: P5.MS1 SJ16.1
E-MS5
  Top 0.254: P5.MS2 SJ11.1
E-MS6
  Top 0.254: P5.MS3 SJ6.1
E-RESETSLEEP
  Bottom 0.254: P4.!RST P4.!SLP
E-RESETSLEEP1
  Bottom 0.254: P5.!SLP P5.!RST
E-STOP
  Top 0.254: JP12.1 67.82,4.06 66.29,5.59 54.36,5.59 53.34,6.6 53.34,19.32 IC1.18
ENDSTOP+V
  Top 0.406: JP11.2 49.53,2.03 50.29,1.27 56.64,1.27 57.4,2.03 | JP10.2 57.4,2.03 | 57.4,2.03 58.17,1.27 64.52,1.27 65.28,2.03 JP12.2
  Bottom 0.406: JP6.2 JP10.2
GND  (via drill 0.4, 0.5, 0.5 pad 0.25)
  other vias: 34.42,17.53 24.89,4.83 24.89,3.3 24.89,1.78 47.5,34.29 67.82,14.61 70.48,22.1 77.98,12.19 57.91,21.08 62.48,16.51 50.8,20.57 49.02,25.4 42.67,28.96 48.01,27.94 59.18,29.21 52.58,34.04 41.66,37.34 45.72,38.1 38.35,41.15 64.01,14.61 66.04,9.14 62.23,6.86 67.06,7.11 82.3,10.92 93.73,10.16 93.73,1.65 93.22,14.22 92.46,20.32 72.52,22.86 76.33,16.51 77.47,41.15 64.52,33.27 74.17,41.15 75.95,35.81 82.55,52.83 95,65.28 92.96,45.72 95,64.26 77.22,55.37 88.14,43.18 95,62.23 95,63.25 59.44,55.37 41.66,55.37 23.88,55.37 68.33,50.04 50.55,50.04 28.7,55.37 52.32,46.48 59.18,46.48 53.98,44.32 65.53,41.02 55.37,46.48 59.69,37.08 64.77,46.99 72.9,46.48 69.09,36.32 78.99,46.23 71.88,35.56 92.96,33.53 99.57,34.54 43.18,20.32 32,26.67 42.67,23.62 32.51,10.67 24.38,10.92 25.65,10.92 26.92,10.92 25.91,21.59 25.91,29.21 26.42,39.37 20.83,39.12 32.77,32 40.89,32.26 25.91,20.07 32.77,29.46 25.15,8.13 26.42,8.13 32.51,8.13 33.78,8.13 33.78,10.67 20.83,21.59 20.83,20.32 20.83,19.05 20.83,29.21 20.83,27.94 20.83,26.67 20.83,37.85 20.83,36.58 20.83,35.31 25.91,46.74 24.64,46.74 23.37,46.74 22.1,46.74 59.94,9.65 64.01,9.14 78.74,1.78 49.28,46.48 43.69,39.88 28.7,57.91 28.7,52.83 95,54.36 52.83,25.4 56.64,31.75 44.45,11.43 83.69,4.19 31.5,21.34 77.98,14.61 62.23,22.23 28.19,10.92 27.69,8.13 28.96,8.13 34.67,22.35 30.48,24.64 30.48,26.67 39.62,27.43 33.53,24.64 74.3,18.29 20.83,25.4 20.83,17.78 51.31,13.72 37.97,24.89 32,24.64 33.53,26.67 36.58,35.05 38.86,33.78 89.66,36.58 92.96,41.91 88.14,42.16 88.14,44.2 84.58,45.47 84.58,44.2 84.58,42.93 94.49,37.08 98.55,51.31 99.57,51.31
  pour Top (isolate 0.254, rank 6): -6.35,78.23 106.68,78.23 106.68,-3.05 -6.35,-3.05
  pour Bottom (isolate 0.254, rank 6, no thermals): -5.08,76.96 105.41,76.96 105.41,-1.78 -5.08,-1.78
  pour Bottom (rank 2, no thermals): 24.13,5.59 18.08,5.59 17.53,5.03 17.53,3.94 16.76,3.05 10.41,3.05 10.41,0 24.13,0
  pour Bottom (no thermals): 23.11,66.29 20.57,66.29 16.26,61.98 16.26,51.82 20.07,48.01 23.11,48.01
  pour Bottom (no thermals): 40.89,66.29 38.35,66.29 33.02,60.96 33.02,52.32 35.81,49.53 40.89,49.53
  pour Bottom (no thermals): 58.67,66.55 56.13,66.55 50.8,61.21 50.8,52.58 53.59,49.78 58.67,49.78
HOTBED-GND  (via drill 0.5)
  other vias: 8.38,23.88 9.65,23.88 10.92,23.88 12.19,23.88 13.46,23.88 13.46,17.78 12.19,17.78 10.92,17.78 9.65,17.78 8.38,17.78 8.38,19.3 8.38,20.83 8.38,22.35
  pour Bottom (no thermals): 2.54,24.38 13.97,24.38 13.97,17.27 2.54,17.27
  pour Top (no thermals): 2.54,24.38 13.97,24.38 13.97,17.27 2.54,17.27
HOTEND-GND  (via drill 0.5)
  other vias: 7.62,44.96 7.62,43.18 7.62,41.4
  pour Bottom (no thermals): 3.05,45.47 8.38,45.47 8.38,40.89 3.05,40.89
  pour Top (no thermals): 3.05,45.47 13.21,45.47 13.21,40.89 3.05,40.89
HOTEND-GND1  (via drill 0.5)
  other vias: 7.62,34.29 7.62,32.51 7.62,30.73
  pour Bottom (no thermals): 3.05,34.8 8.38,34.8 8.38,30.23 3.05,30.23
  pour Top (no thermals): 3.05,34.8 13.21,34.8 13.21,30.23 3.05,30.23
MISO  (via drill 0.4)
  Top 0.254: v72.39,7.62 71.88,8.13 71.88,8.38 71.45,8.81 U4.13 | IC1.13 47.24,20.56 v47.24,18.29
  Bottom 0.254: JP7.6 76.45,5.08 73.91,7.62 v72.39,7.62 72.39,9.14 69.6,11.94 50.29,11.94 47.24,14.99 v47.24,18.29
MOSI  (via drill 0.4)
  Top 0.254: v68.58,10.41 69.01,10.11 U4.11 | IC1.12 46.23,20.68 v46.23,17.27
  Bottom 0.254: JP7.3 72.64,3.05 72.64,5.08 68.96,8.89 68.83,9.02 68.83,10.16 v68.58,10.41 67.82,11.18 49.78,11.18 46.23,14.73 v46.23,17.27
N$1
  Top 0.254: LED1.A R1.1
N$2
  Top 0.305: Q3.4 19.68,22.73 20.07,23.11 R11.2
N$3
  Top 0.254: IC1.4 38.66,22.16 R6.2
N$4
  Top 0.254: IC1.5 39.42,21.79 39.37,21.74 39.24,21.61 R7.2
N$5
  Top 1.016: F1.P$2 98.3,64.01 JP2.2
N$6
  Top 0.813: Q1.3 96.87,49.21
  Top 1.016: 96.87,49.21 D2.C 96.87,54.45 98.3,55.88 F1.P$1
N$8
  Bottom 0.254: 99.31,12.57 arc180 97.03,14.1 arc180 94.74,12.57 97.03,10.16 99.31,12.57
N$10
  Top 0.254: Q1.1 99.31,46.99 99.06,46.74 R3.2
N$11
  Top 0.305: R9.2 20.32,40.64 15.88,45.09 Q2.4
N$13
  Top 0.305: Q4.4 17.11,34.42 R15.2
PB4  (via drill 0.4)
  Top 0.254: v77.85,24.13 77.98,24.13 80.52,21.59 94.36,21.59 95.38,20.57 98.3,20.57 J6.5 | IC1.14 v51.18,23.37
  Bottom 0.254: v77.85,24.13 51.94,24.13 v51.18,23.37
PD0-SCL
  Top 0.254: J6.6 96.27,21.84 95.25,22.61 80.77,22.61 77.98,25.4 66.55,25.4 64.64,23.5 57.08,23.5 IC1.25
PD1-SDA
  Top 0.254: J6.7 98.3,23.11 96.27,23.11 95.76,23.62 81.03,23.62 78.49,26.16 66.29,26.16 64.26,24.13 57.58,24.13 IC1.26
PD2-RX1
  Top 0.254: J6.8 81.53,24.38 78.99,26.92 66.04,26.92 63.75,24.64 58.2,24.64 IC1.27
PD3-TX1
  Top 0.254: J6.9 98.3,25.65 81.53,25.65 79.5,27.69 65.79,27.69 63.25,25.15 58.82,25.15 IC1.28
PD4
  Top 0.254: J6.10 81.79,26.92 80.26,28.45 65.53,28.45 62.87,25.78 59.32,25.78 IC1.29
PD5
  Top 0.254: J6.11 98.3,28.19 82.04,28.19 81.03,29.21 65.28,29.21 62.36,26.29 59.94,26.29 IC1.30
PD6
  Top 0.254: J6.12 82.3,29.46 81.79,29.97 65.02,29.97 61.85,26.8 60.57,26.8 IC1.31
PD7
  Top 0.254: J6.13 98.3,30.73 63.35,30.73 IC1.32
PE0
  Top 0.254: J6.14 82.8,32 82.3,31.5 61.57,31.5 IC1.33
PE5  (via drill 0.4)
  Top 0.254: IC1.19 52.07,21.72 v52.07,22.35
  Bottom 0.254: J6.4 91.95,19.3 90.93,18.29 75.69,18.29 70.87,23.11 52.83,23.11 v52.07,22.35
SCLK  (via drill 0.4)
  Top 0.254: JP7.4 73.91,7.37 71.82,9.46 U4.12 67.88,9.46 v67.82,9.4 | IC1.11 45.21,20.79 v45.21,16.26
  Bottom 0.254: v67.82,9.4 66.8,10.41 49.28,10.41 45.21,14.48 v45.21,16.26
SDCD  (via drill 0.4)
  Top 0.254: v88.14,13.72 90.17,13.72 91.31,12.58 J1.CD2 | IC1.17 51.82,19.2 v51.82,17.78
  Bottom 0.254: v88.14,13.72 54.61,13.72 51.82,16.51 v51.82,17.78
SDCLK
  Top 0.254: U4.3 77.66,9.46 78.23,8.89 78.23,7.37 80.52,5.08 84.07,5.08 85.09,4.06 J1.5
  Top 0.305: J1.5
SDCS  (via drill 0.4)
  Top 0.254: U4.10 69.5,10.76 68.83,11.43 v68.83,12.7 | IC1.10 46.91,23.62 v47.75,23.62
  Bottom 0.254: v47.75,23.62 49.78,21.59 49.78,13.72 50.8,12.7 v68.83,12.7
SDCSH
  Top 0.254: U4.5 78.65,10.76 79.5,9.91 79.5,7.87 81.28,6.1 85.6,6.1 88.39,3.3 J1.2
SDDI
  Top 0.254: U4.4 78.19,10.11 78.99,9.31 78.99,7.62 81.03,5.59 85.34,5.59 87.29,3.64 J1.3
SDDO
  Top 0.254: U4.2 77.04,8.81 77.47,8.38 77.47,7.11 80.26,4.32 82.3,4.32 82.89,3.73 J1.7
UCAP
  Top 0.254: C9.2 43.69,23.11 43.69,23.8 IC1.7
USB_DN
  Top 0.254: J2.D- 30.59,5.07 30.61,5.21 30.61,14.61 31.94,15.94 31.94,17.97 32.45,18.48 U2.3 34.99,18.48 37.03,20.52 R6.1
USB_DP
  Top 0.254: J2.D+ 31.24,14.22 33.28,16.26 U2.1 34.86,16.58 35.56,17.27 35.56,18.03 37.47,19.95 R7.1
VBUS
  Top 0.406: J2.VBUS 29.94,15.52 29.84,15.62 29.84,17.53 | U2.5 29.84,17.53 | 29.84,17.53 SJ1.1 31.65,20.03 C5.2 34.25,20.03 37.59,23.37 38.73,23.37 IC1.3 43.05,27.69 43.69,27.69 45.97,25.4 45.97,24.95 IC1.8
X-DIR
  Top 0.254: P1.DIR 12.19,50.29 13.72,48.77 17.53,48.77 21.08,45.21 42.16,45.21 46.99,40.39 46.99,39.24 IC1.51
X-MOT-1A
  Top 1.422: P1.1A 20.32,57.91 15.49,62.74 15.49,71.12 13.97,72.64 JP16.2
X-MOT-1B
  Top 1.422: P1.1B 20.32,55.37 13.72,61.98 13.72,70.36 11.43,72.64 JP16.1
X-MOT-2A
  Top 1.422: P1.2A 20.32,60.45 17.27,63.5 17.27,71.88 16.51,72.64 JP16.3
X-MOT-2B
  Top 1.422: P1.2B 20.32,62.99 19.05,64.26 JP16.4
X-MS1
  Top 0.406: SJ12.1 P1.MS1
X-MS2
  Top 0.406: SJ7.1 P1.MS2
X-MS3
  Top 0.406: SJ2.1 P1.MS3
X-RESETSLEEP
  Bottom 0.254: P1.!RST P1.!SLP
X-STEP
  Top 0.254: P1.STEP 10.67,52.83 14.22,49.28 18.03,49.28 21.59,45.72 42.67,45.72 47.5,40.89 47.5,39.87 IC1.50
X-STOP
  Top 0.254: JP10.1 58.17,4.83 53.59,4.83 49.02,9.4 49.02,18.95 IC1.16
XTAL1
  Top 0.254: IC1.24 56.09,23.41 57.15,22.35 60.06,22.35 C13.2 61.87,20.55 X1.P$2
XTAL2
  Top 0.254: IC1.23 56.64,21.67 56.64,18.93 C12.2 58.7,16.87 X1.P$1
Y-DIR
  Top 0.254: P2.DIR 29.97,46.99 43.43,46.99 48.51,41.91 49.13,41.91 IC1.48
Y-MOT-1A
  Top 1.422: P2.1A 38.1,57.91 33.27,62.81 33.27,71.12 31.75,72.64 JP17.2
Y-MOT-1B
  Top 1.422: P2.1B 38.1,55.37 31.5,62.06 31.5,70.36 29.21,72.64 JP17.1
Y-MOT-2A
  Top 1.422: P2.2A 38.1,60.45 35.05,63.5 35.05,71.88 34.29,72.64 JP17.3
Y-MOT-2B
  Top 1.422: P2.2B 38.1,62.99 36.83,64.26 JP17.4
Y-MS1
  Top 0.254: P2.MS1 SJ13.1
Y-MS2
  Top 0.254: P2.MS2 SJ8.1
Y-MS3
  Top 0.254: P2.MS3 SJ3.1
Y-RESETSLEEP
  Bottom 0.254: P2.!RST P2.!SLP
Y-STEP
  Top 0.254: P2.STEP 32,47.5 43.94,47.5 48.77,42.67 50.04,42.67 53.34,39.37 53.34,39.1 IC1.47
Y-STOP
  Top 0.254: JP11.1 52.07,5.33 48.26,9.14 48.26,19.32 IC1.15
Z-DIR
  Top 0.254: P3.DIR 44.45,49.02 49.28,44.2 50.55,44.2 54.36,40.39 54.36,37.86 IC1.45
Z-MOT-1A
  Top 1.422: P3.1A 55.88,57.91 51.05,62.74 51.05,71.12 49.53,72.64 JP20.2
Z-MOT-1B
  Top 1.422: P3.1B 55.88,55.37 49.28,61.98 49.28,70.36 46.99,72.64 JP20.1
Z-MOT-2A
  Top 1.422: P3.2A 55.88,60.45 52.83,63.5 52.83,71.88 52.07,72.64 JP20.3
Z-MOT-2B
  Top 1.422: P3.2B 55.88,62.99 54.61,64.26 JP20.4
Z-MS1
  Top 0.254: P3.MS1 SJ14.1
Z-MS2
  Top 0.254: P3.MS2 SJ9.1
Z-MS3
  Top 0.254: P3.MS3 SJ4.1
Z-RESETSLEEP
  Bottom 0.254: P3.!RST P3.!SLP
Z-STEP
  Top 0.254: P3.STEP 45.97,51.31 45.97,48.51 49.53,44.96 50.8,44.96 54.86,40.89 54.86,37.23 IC1.44
Z-STOP
  Top 0.254: JP9.1 44.2,4.32 45.97,6.1 45.97,11.43 44.2,13.21 44.2,22.04 IC1.9
Z-STOP-SUPPLY
  Top 0.406: JP8.2 JP9.2

### Text on the board
Bottom: Nur